# Altium schematic sheet SCH1.SchDoc: ATMEGA2560
size A4; SheetNumber: 1; SheetTotal: 2
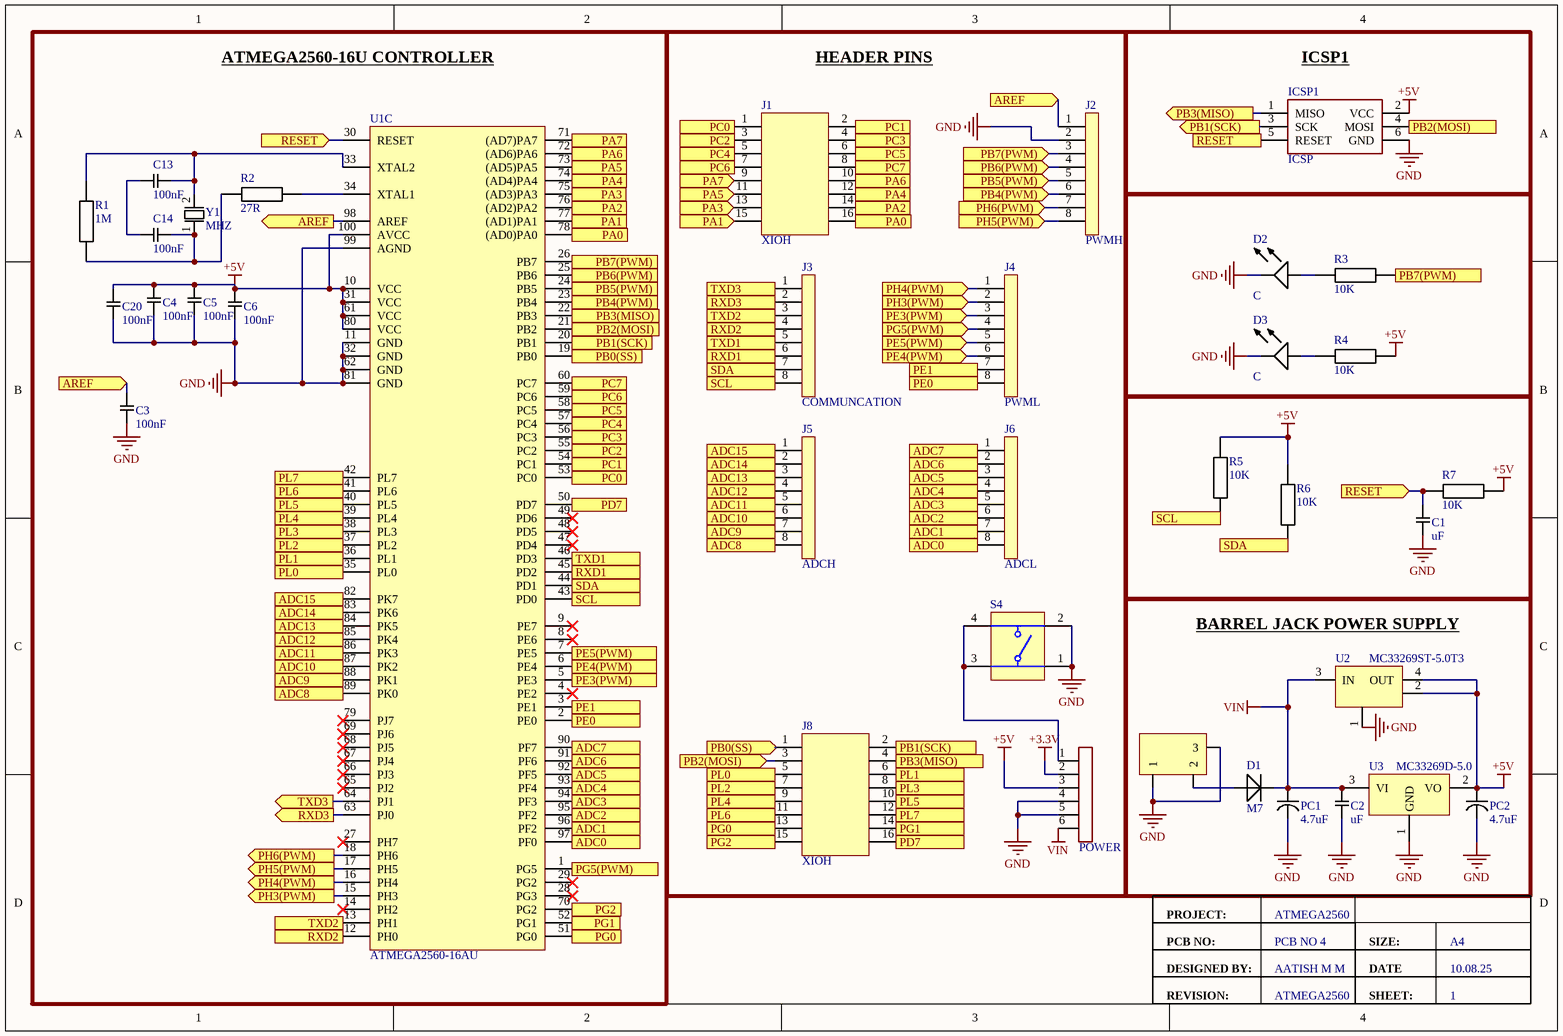
[diagram p0: SCH1.SchDoc]

## Parts
C1  uF  [CAPACITOR]
C2  uF  [CAPACITOR]
C3  100nF  [CAPACITOR]
C4  100nF  [CAPACITOR]
C5  100nF  [CAPACITOR]
C6  100nF  [CAPACITOR]
C13  100nF  [CAPACITOR]
C14  100nF  [CAPACITOR]
C20  100nF  [CAPACITOR]
D1  M7  [DIODE M7]
D2  C  [LED]
D3  C  [LED]
ICSP1  ICSP  [ICSP]
J1  XIOH  [16 PIN Header]
J2  PWMH  [Female header]
J3  COMMUNCATION  [Female header]
J4  PWML  [Female header]
J5  ADCH  [Female header]
J6  ADCL  [Female header]
J7  POWER  [6 PIN FH]
J8  XIOH  [16 PIN Header]
PC1  4.7uF  [POLARIZED CAP]
PC2  4.7uF  [POLARIZED CAP]
PWRDC  BARREL JACK  [BARREL JACK]  (value not drawn)
R1  1M  [RESISTOR]
R2  27R  [RESISTOR]
R3  10K  [RESISTOR]
R4  10K  [RESISTOR]
R5  10K  [RESISTOR]
R6  10K  [RESISTOR]
R7  10K  [RESISTOR]
S4  EVQ-Q2Y03W  [PNSC-EVQQ2_V]  (value not drawn)
U1  ATMEGA2560-16AU  [ATMEGA2560-16AU]  (part C of 3)
U2  MC33269ST-5.0T3  [MC33269ST-3.3T3]
U3  MC33269D-5.0  [MC33269D-5.0]
Y1  MHZ  [ECS-160-20-5PX-TR]

## Ports
ADC0 (in, see SCH1[2D]), ADC0 (out, see SCH1[3C]), ADC1 (in, see SCH1[2D]), ADC1 (out, see SCH1[3C]), ADC2 (in, see SCH1[2D]), ADC2 (out, see SCH1[3C]), ADC3 (in, see SCH1[2D]), ADC3 (out, see SCH1[3B]), ADC4 (in, see SCH1[2D]), ADC4 (out, see SCH1[3B]), ADC5 (in, see SCH1[2D]), ADC5 (out, see SCH1[3B]), ADC6 (in, see SCH1[2C]), ADC6 (out, see SCH1[3B]), ADC7 (in, see SCH1[2C]), ADC7 (out, see SCH1[3B]), ADC8 (in, see SCH1[1C]), ADC8 (out, see SCH1[2C]), ADC9 (in, see SCH1[1C]), ADC9 (out, see SCH1[2C]), ADC10 (in, see SCH1[1C]), ADC10 (out, see SCH1[2C]), ADC11 (in, see SCH1[1C]), ADC11 (out, see SCH1[2B]), ADC12 (in, see SCH1[1C]), ADC12 (out, see SCH1[2B]), ADC13 (in, see SCH1[1C]), ADC13 (out, see SCH1[2B]), ADC14 (in, see SCH1[1C]), ADC14 (out, see SCH1[2B]), ADC15 (in, see SCH1[1C]), ADC15 (out, see SCH1[2B]), AREF (in, see SCH1[1A], SCH1[1B]), AREF (in, see SCH1[1A], SCH1[3A]), AREF (out, see SCH1[1B], SCH1[3A]), PA0 (in, see SCH1[2A]), PA0 (out, see SCH1[3A]), PA1 (in, see SCH1[2A]), PA1 (out, see SCH1[2A]), PA2 (in, see SCH1[2A]), PA2 (out, see SCH1[3A]), PA3 (in, see SCH1[2A]), PA3 (out, see SCH1[2A]), PA4 (in, see SCH1[2A]), PA4 (out, see SCH1[3A]), PA5 (in, see SCH1[2A]), PA5 (out, see SCH1[2A]), PA6 (in, see SCH1[2A]), PA6 (out, see SCH1[3A]), PA7 (in, see SCH1[2A]), PA7 (out, see SCH1[2A]), PB0(SS) (in, see SCH1[2B]), PB0(SS) (out, see SCH1[2C]), PB1(SCK) (in, see SCH1[2B], SCH1[4A]), PB1(SCK) (out, see SCH1[2B], SCH1[3C]), PB1(SCK) (out, see SCH1[3C], SCH1[4A]), PB2(MOSI) (in, see SCH1[2B], SCH1[4A]), PB2(MOSI) (out, see SCH1[2B], SCH1[2C]), PB2(MOSI) (out, see SCH1[2C], SCH1[4A]), PB3(MISO) (in, see SCH1[2B], SCH1[3A]), PB3(MISO) (out, see SCH1[2B], SCH1[3C]), PB3(MISO) (out, see SCH1[3A], SCH1[3C]), PB4(PWM) (in, see SCH1[2B]), PB4(PWM) (out, see SCH1[3A]), PB5(PWM) (in, see SCH1[2B]), PB5(PWM) (out, see SCH1[3A]), PB6(PWM) (in, see SCH1[2B]), PB6(PWM) (out, see SCH1[3A]), PB7(PWM) (in, see SCH1[2B], SCH1[3A]), PB7(PWM) (in, see SCH1[2B], SCH1[4B]), PB7(PWM) (out, see SCH1[3A], SCH1[4B]), PC0 (in, see SCH1[2B]), PC0 (out, see SCH1[2A]), PC1 (in, see SCH1[2B]), PC1 (out, see SCH1[3A]), PC2 (in, see SCH1[2B]), PC2 (out, see SCH1[2A]), PC3 (in, see SCH1[2B]), PC3 (out, see SCH1[3A]), PC4 (in, see SCH1[2B]), PC4 (out, see SCH1[2A]), PC5 (in, see SCH1[2B]), PC5 (out, see SCH1[3A]), PC6 (in, see SCH1[2B]), PC6 (out, see SCH1[2A]), PC7 (in, see SCH1[2B]), PC7 (out, see SCH1[3A]), PD7 (in, see SCH1[2B]), PD7 (out, see SCH1[3D]), PE0 (in, see SCH1[2C], SCH2[3B]), PE0 (out, see SCH1[3B], SCH2[3B]), PE1 (in, see SCH1[2C], SCH2[3C]), PE1 (out, see SCH1[3B], SCH2[3C]), PE3(PWM) (in, see SCH1[2C]), PE3(PWM) (out, see SCH1[3B]), PE4(PWM) (in, see SCH1[2C]), PE4(PWM) (out, see SCH1[3B]), PE5(PWM) (in, see SCH1[2C]), PE5(PWM) (out, see SCH1[3B]), PG0 (in, see SCH1[2D]), PG0 (out, see SCH1[2D]), PG1 (in, see SCH1[2D]), PG1 (out, see SCH1[3D]), PG2 (in, see SCH1[2D]), PG2 (out, see SCH1[2D]), PG5(PWM) (in, see SCH1[2D]), PG5(PWM) (out, see SCH1[3B]), PH3(PWM) (in, see SCH1[1D]), PH3(PWM) (out, see SCH1[3B]), PH4(PWM) (in, see SCH1[1D]), PH4(PWM) (out, see SCH1[3B]), PH5(PWM) (in, see SCH1[1D]), PH5(PWM) (out, see SCH1[3A]), PH6(PWM) (in, see SCH1[1D]), PH6(PWM) (out, see SCH1[3A]), PL0 (in, see SCH1[1C]), PL0 (out, see SCH1[2D]), PL1 (in, see SCH1[1C]), PL1 (out, see SCH1[3D]), PL2 (in, see SCH1[1C]), PL2 (out, see SCH1[2D]), PL3 (in, see SCH1[1C]), PL3 (out, see SCH1[3D]), PL4 (in, see SCH1[1C]), PL4 (out, see SCH1[2D]), PL5 (in, see SCH1[1B]), PL5 (out, see SCH1[3D]), PL6 (in, see SCH1[1B]), PL6 (out, see SCH1[2D]), PL7 (in, see SCH1[1B]), PL7 (out, see SCH1[3D]), RESET (in, see SCH1[1A], SCH1[4A], SCH2[4B]), RESET (in, see SCH1[4A], SCH1[4B], SCH2[4B]), RESET (out, see SCH1[1A], SCH1[4B], SCH2[4B]), RXD1 (in, see SCH1[2C]), RXD1 (out, see SCH1[2B]), RXD2 (in, see SCH1[1D]), RXD2 (out, see SCH1[2B]), RXD3 (in, see SCH1[1D]), RXD3 (out, see SCH1[2B]), SCL (in, see SCH1[2B], SCH1[2C]), SCL (in, see SCH1[2C], SCH1[3C]), SCL (out, see SCH1[2B], SCH1[3C]), SDA (in, see SCH1[2B], SCH1[2C]), SDA (in, see SCH1[2C], SCH1[4C]), SDA (out, see SCH1[2B], SCH1[4C]), TXD1 (in, see SCH1[2C]), TXD1 (out, see SCH1[2B]), TXD2 (in, see SCH1[1D]), TXD2 (out, see SCH1[2B]), TXD3 (in, see SCH1[1D]), TXD3 (out, see SCH1[2B])

## Nets
+3.3V: J7.2
+5V: C4.2 C5.2 C6.2 C20.2 ICSP1.2(VCC) J7.3 PC2.1 R4.2 R5.2 R6.2 R7.2 U1.10(VCC) U1.31(VCC) U1.61(VCC) U1.80(VCC) U1.100(AVCC) U2.2 U2.4(OUT) U3.2(VO)
GND: C1.1 C2.1 C3.1 C4.1 C5.1 C6.1 C20.1 D2.2 D3.2 ICSP1.6(GND) J2.2 J7.4 J7.5 PC1.2 PC2.2 PWRDC.1 PWRDC.3 S4.1(A) S4.2(B) U1.11(GND) U1.32(GND) U1.62(GND) U1.81(GND) U1.99(AGND) U2.1 U3.1(GND)
VIN: C2.2 D1.2 J7.6 PC1.1 U2.3(IN) U3.3(VI)
ADC0: J6.8 U1.97(PF0) ; port ADC0
ADC1: J6.7 U1.96(PF2) ; port ADC1
ADC2: J6.6 U1.95(PF2) ; port ADC2
ADC3: J6.5 U1.94(PF3) ; port ADC3
ADC4: J6.4 U1.93(PF4) ; port ADC4
ADC5: J6.3 U1.92(PF5) ; port ADC5
ADC6: J6.2 U1.91(PF6) ; port ADC6
ADC7: J6.1 U1.90(PF7) ; port ADC7
ADC8: J5.8 U1.89(PK0) ; port ADC8
ADC9: J5.7 U1.88(PK1) ; port ADC9
ADC10: J5.6 U1.87(PK2) ; port ADC10
ADC11: J5.5 U1.86(PK3) ; port ADC11
ADC12: J5.4 U1.85(PK4) ; port ADC12
ADC13: J5.3 U1.84(PK5) ; port ADC13
ADC14: J5.2 U1.83(PK6) ; port ADC14
ADC15: J5.1 U1.82(PK7) ; port ADC15
AREF: C3.2 J2.1 U1.98(AREF) ; port AREF
PA0: J1.16 U1.78((AD0)PA0) ; port PA0
PA1: J1.15 U1.77((AD1)PA1) ; port PA1
PA2: J1.14 U1.76((AD2)PA2) ; port PA2
PA3: J1.13 U1.75((AD3)PA3) ; port PA3
PA4: J1.12 U1.74((AD4)PA4) ; port PA4
PA5: J1.11 U1.73((AD5)PA5) ; port PA5
PA6: J1.10 U1.72((AD6)PA6) ; port PA6
PA7: J1.9 U1.71((AD7)PA7) ; port PA7
PB0(SS): J8.1 U1.19(PB0) ; port PB0(SS)
PB1(SCK): ICSP1.3(SCK) J8.2 U1.20(PB1) ; port PB1(SCK)
PB2(MOSI): ICSP1.4(MOSI) J8.3 U1.21(PB2) ; port PB2(MOSI)
PB3(MISO): ICSP1.1(MISO) J8.4 U1.22(PB3) ; port PB3(MISO)
PB4(PWM): J2.6 U1.23(PB4) ; port PB4(PWM)
PB5(PWM): J2.5 U1.24(PB5) ; port PB5(PWM)
PB6(PWM): J2.4 U1.25(PB6) ; port PB6(PWM)
PB7(PWM): J2.3 R3.2 U1.26(PB7) ; port PB7(PWM)
PC0: J1.1 U1.53(PC0) ; port PC0
PC1: J1.2 U1.54(PC1) ; port PC1
PC2: J1.3 U1.55(PC2) ; port PC2
PC3: J1.4 U1.56(PC3) ; port PC3
PC4: J1.5 U1.57(PC4) ; port PC4
PC5: J1.6 U1.58(PC5) ; port PC5
PC6: J1.7 U1.59(PC6) ; port PC6
PC7: J1.8 U1.60(PC7) ; port PC7
PD7: J8.16 U1.50(PD7) ; port PD7
PE0: J4.8 U1.2(PE0) ; port PE0
PE1: J4.7 U1.3(PE1) ; port PE1
PE3(PWM): J4.3 U1.5(PE3) ; port PE3(PWM)
PE4(PWM): J4.6 U1.6(PE4) ; port PE4(PWM)
PE5(PWM): J4.5 U1.7(PE5) ; port PE5(PWM)
PG0: J8.13 U1.51(PG0) ; port PG0
PG1: J8.14 U1.52(PG1) ; port PG1
PG2: J8.15 U1.70(PG2) ; port PG2
PG5(PWM): J4.4 U1.1(PG5) ; port PG5(PWM)
PH3(PWM): J4.2 U1.15(PH3) ; port PH3(PWM)
PH4(PWM): J4.1 U1.16(PH4) ; port PH4(PWM)
PH5(PWM): J2.8 U1.17(PH5) ; port PH5(PWM)
PH6(PWM): J2.7 U1.18(PH6) ; port PH6(PWM)
PL0: J8.5 U1.35(PL0) ; port PL0
PL1: J8.6 U1.36(PL1) ; port PL1
PL2: J8.7 U1.37(PL2) ; port PL2
PL3: J8.8 U1.38(PL3) ; port PL3
PL4: J8.9 U1.39(PL4) ; port PL4
PL5: J8.10 U1.40(PL5) ; port PL5
PL6: J8.11 U1.41(PL6) ; port PL6
PL7: J8.12 U1.42(PL7) ; port PL7
RESET: C1.2 ICSP1.5(RESET) R7.1 U1.30(RESET) ; port RESET
RXD1: J3.6 U1.45(PD2) ; port RXD1
RXD2: J3.4 U1.12(PH0) ; port RXD2
RXD3: J3.2 U1.63(PJ0) ; port RXD3
SCL: J3.8 R5.1 U1.43(PD0) ; port SCL
SDA: J3.7 R6.1 U1.44(PD1) ; port SDA
TXD1: J3.5 U1.46(PD3) ; port TXD1
TXD2: J3.3 U1.13(PH1) ; port TXD2
TXD3: J3.1 U1.64(PJ1) ; port TXD3
NetC13_1: C13.1 C14.1
NetC13_2: C13.2 R1.2 U1.33(XTAL2) Y1.2
NetC14_2: C14.2 R1.1 R2.1 Y1.1
NetD1_1: D1.1 PWRDC.2
NetD2_1: D2.1 R3.1
NetD3_1: D3.1 R4.1
NetJ7_1: J7.1 S4.3(A') S4.4(B')
NetR2_2: R2.2 U1.34(XTAL1)

Not connected (* = marked no-connect by the designer): U1 4(PE2)* 8(PE6)* 9(PE7)* 14(PH2)* 27(PH7)* 28(PG3)* 29(PG2)* 47(PD4)* 48(PD5)* 49(PD6)* 65(PJ2)* 66(PJ3)* 67(PJ4)* 68(PJ5)* 69(PJ6)* 79(PJ7)*

## Notes on the sheet
- ATMEGA2560-16U CONTROLLER
- HEADER PINS
- (near ICSP1) ICSP1
- (near U2) BARREL JACK POWER SUPPLY
- PROJECT:
- ATMEGA2560
- PCB NO:
- DESIGNED BY:
- PCB NO 4
- AATISH M M
- SIZE:
- DATE
- A4
- 10.08.25
- REVISION:
- SHEET:

## Library data of the parts
C1-C6 C13 C14 C20 = CAPACITOR
D1 = DIODE
D2 D3 = LED
J2-J6 = HEADER PINS
PC1 PC2 = POLARIZED CAP
R1-R7 = RESISTOR
S4 = CMP-2000-06232-1: Light Touch Switche, 3.5 N Force, Height 3.1 mm, -40 to 85 degC, 4-Pin SMD, RoHS, Tape and Reel; Manufacturer: Panasonic; Switch Terminals: Solder; Contact Current Rating: 20mA; Switch Operation: Off-On; External Length / Height: 3.1mm; External Depth: 1.8mm; Body Width: 6.5mm; No. of Ways: 1; Contact Voltage DC Max: 15V; Dielectric Strength VAC: 250V; Actuation Type: Top; Operating Force Min: 3.5N; Body Depth: 6mm; SVHC: NoSVHC(16-Dec-2013); Actuator / Cap Colour: White; No. of Mechanical Operations: 100000; Contact Resistance Max: 100mohm; Contact Configuration: SPST-NO; Datasheet Version: 09/2014; Mounting Technology: SurfaceMount; Height: 3.1mm; Datasheet URL: http://download.siliconexpert.com/pdfs/2014/10/4/5/54/9/232/pns_/manual/8atk0000ce28.pdf; Contact Current Max: 20mA; Package Description: 4-Pin Surface Mount Device, Body 6.5 x 6 mm; Contact Current DC Max: 20mA; Operating Temperature Max: 85°C; External Width: 6.5mm; Manufacturer URL: http://www.panasonic.com/; Package Reference: EVQQ2; Terminal Type: SMD; No. of Poles: 1; Contact Voltage AC Max: 250V; Operating Force: 3.5N; Contact Voltage DC Nom: 15V; Operating Temperature Min: -40°C; Series: EVQQ2; ComponentLink1Description: New link; ComponentLink1URL: *
Y1 = XTAL